# Altium schematic sheet Communication.SchDoc
size B portrait; Organization: Protel International P/L; Address1: L3, 12a Rodborough Rd; Address2: Frenchs Forest; Address3: NSW; Address4: Australia 2086
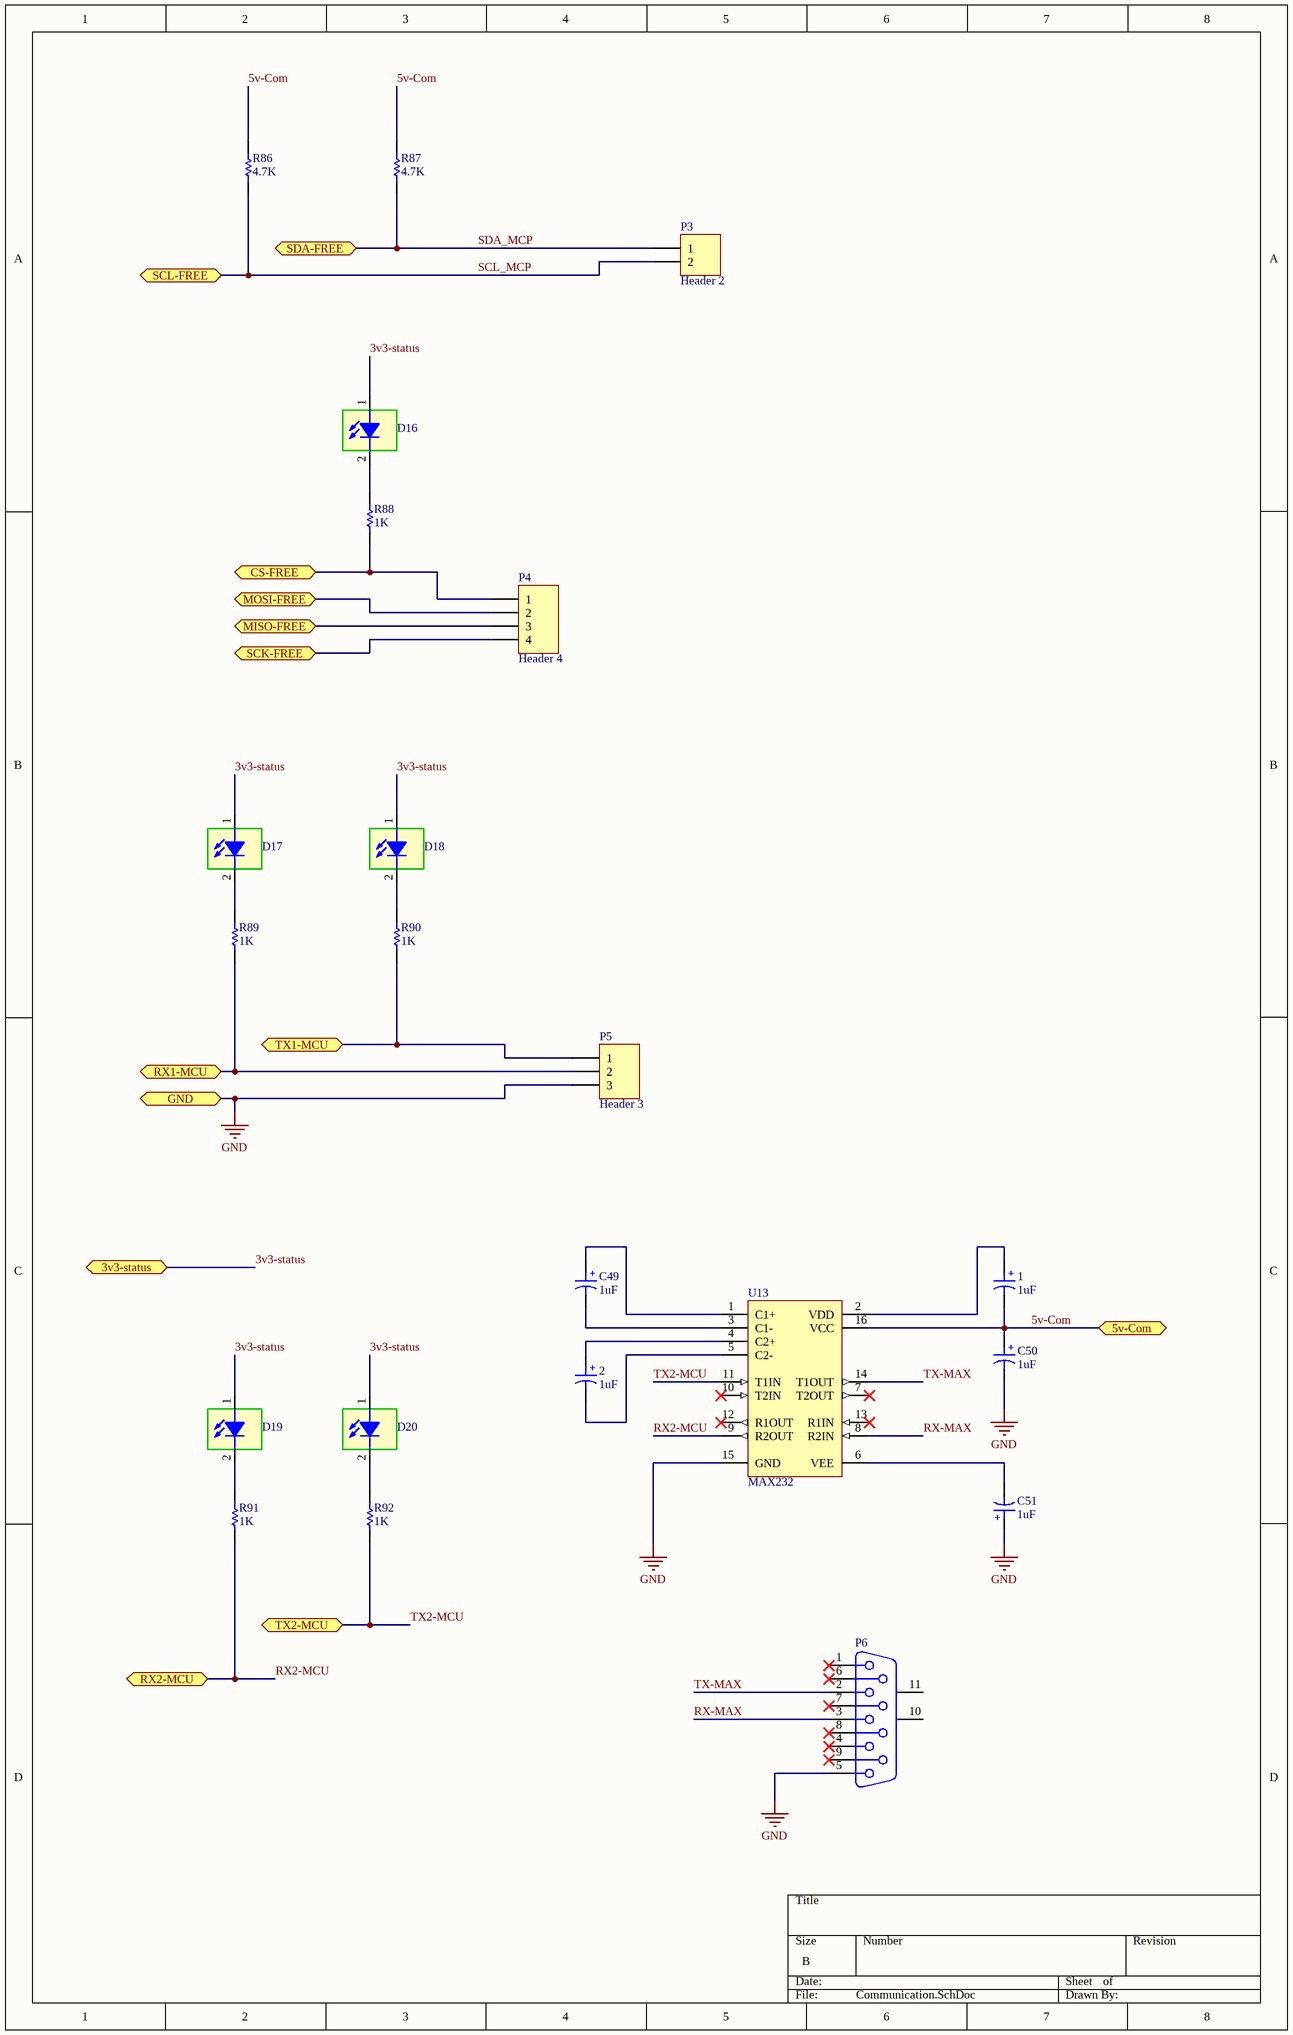
[diagram p0: Communication.SchDoc]

## Parts
1  1uF  [Cap1206_(3216X18L)Size A]
2  1uF  [Cap1206_(3216X18L)Size A]
C49  1uF  [Cap1206_(3216X18L)Size A]
C50  1uF  [Cap1206_(3216X18L)Size A]
C51  1uF  [Cap1206_(3216X18L)Size A]
D16  SMD 1206 LED  [LED 1206]  (value not drawn)
D17  SMD 1206 LED  [LED 1206]  (value not drawn)
D18  SMD 1206 LED  [LED 1206]  (value not drawn)
D19  SMD 1206 LED  [LED 1206]  (value not drawn)
D20  SMD 1206 LED  [LED 1206]  (value not drawn)
P3  Header 2  [HDR1X2]
P4  Header 4  [HDR1X4]
P5  Header 3  [HDR1X3]
P6  DB9 Connector  [DB9 Female]  (value not drawn)
R86  4.7K  [RESC3413X04N]
R87  4.7K  [RESC3413X04N]
R88  1K  [RESC3413X04N]
R89  1K  [RESC3413X04N]
R90  1K  [RESC3413X04N]
R91  1K  [RESC3413X04N]
R92  1K  [RESC3413X04N]
U13  MAX232  [SOIC-16]

## Ports
3v3-status (bidir), 5v-Com (bidir), CS-FREE (bidir), GND (bidir), MISO-FREE (bidir), MOSI-FREE (bidir), RX1-MCU (bidir), RX2-MCU (bidir), SCK-FREE (bidir), SCL-FREE (bidir), SDA-FREE (bidir), TX1-MCU (bidir), TX2-MCU (bidir)

## Nets
GND: C50.2 C51.1 P5.3 P6.5 U13.15(GND) ; port GND
3v3-status: D16.1 D17.1 D18.1 D19.1 D20.1 ; port 3v3-status
5v-Com: 1.2 C50.1 R86.2 R87.2 U13.16(VCC) ; port 5v-Com
CS-FREE: P4.1 R88.1 ; port CS-FREE
MISO-FREE: P4.3 ; port MISO-FREE
MOSI-FREE: P4.2 ; port MOSI-FREE
RX1-MCU: P5.2 R89.1 ; port RX1-MCU
RX2-MCU: R91.1 U13.9(R2OUT) ; port RX2-MCU
RX-MAX: P6.3 U13.8(R2IN)
SCK-FREE: P4.4 ; port SCK-FREE
SCL_MCP: P3.2 R86.1 ; port SCL-FREE
SDA_MCP: P3.1 R87.1 ; port SDA-FREE
TX1-MCU: P5.1 R90.1 ; port TX1-MCU
TX2-MCU: R92.1 U13.11(T1IN) ; port TX2-MCU
TX-MAX: P6.2 U13.14(T1OUT)
Net1_1: 1.1 U13.2(VDD)
Net2_1: 2.1 U13.4(C2+)
Net2_2: 2.2 U13.5(C2-)
NetC49_1: C49.1 U13.1(C1+)
NetC49_2: C49.2 U13.3(C1-)
NetC51_2: C51.2 U13.6(VEE)
NetD16_2: D16.2 R88.2
NetD17_2: D17.2 R89.2
NetD18_2: D18.2 R90.2
NetD19_2: D19.2 R91.2
NetD20_2: D20.2 R92.2

Not connected (* = marked no-connect by the designer): P6 1* 4* 6* 7* 8* 9* 10(MH1) 11(MH2); U13 7(T2OUT)* 10(T2IN)* 12(R1OUT)* 13(R1IN)*

## Notes on the sheet
- Title
- Size:
- Date:
- B
- Number:
- Time:
- Revision:
- Sheet
- of
- File:
- (in symbol Cap ELECTROLITIC TOTAL SIZE) +

## Library data of the parts
1 2 C49-C51 = Cap ELECTROLITIC TOTAL SIZE: Cap electrolitic radial; Designer: Abbas Basereh; Data: 16-12-2016; Part. No: *; VALUE: 1uF
D16-D20 = LED SMD 1206
P3 = Header 2: Header, 2-Pin; LatestRevisionDate: 17-Jul-2002; LatestRevisionNote: Re-released for DXP Platform.; Publisher: Altium Limited
P4 = Header 4: Header, 4-Pin; LatestRevisionDate: 17-Jul-2002; LatestRevisionNote: Re-released for DXP Platform.; Publisher: Altium Limited
P5 = Header 3: Header, 3-Pin; LatestRevisionDate: 17-Jul-2002; LatestRevisionNote: Re-released for DXP Platform.; Publisher: Altium Limited
P6 = DB9 Connector: Receptacle Assembly, 9 Position, Right Angle; PackageDocument: O; Positions: 9; Published: 15-Jun-2001; LatestRevisionDate: 17-Jul-2002; LatestRevisionNote: Re-released for DXP Platform.; DatasheetDocument: 1-Sep-1999; PackageReference: 788750; Publisher: Altium Limited; Orientation: Right Angle; Gender: Receptacle
R86-R92 = RES 0805 0.125W: RES 0805; Designer: Abbas Basereh; Desc.: RES SMD 0805; Data: 16-12-2016
U13 = MAX232: +5V Powered RS-232 Driver/Receiver; Published: 16-Jan-2001; LatestRevisionDate: 06-Jun-2005; LatestRevisionNote: Stylized 3D Model Added.; DatasheetVersion: Apr-1992; PackageVersion: 1997; PackageReference: PE16A; Publisher: Altium Limited; PackageDescription: DIP; 16 Leads; Row Spacing 7.62 mm; Pitch 2.54 mm; Code_JEDEC: MS-001-BB; ComponentLink1Description: Manufacturer Link; ComponentLink1URL: http://www.maxim-ic.com/; ComponentLink2Description: Datasheet; ComponentLink2URL: http://pdfserv.maxim-ic.com/en/ds/MAX220-MAX249.pdf